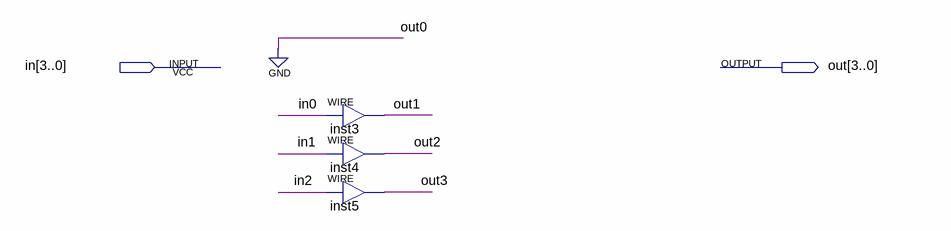
[diagram p0: schematic sheet]
// Quartus schematic shifter.bdf as structural Verilog: 3 symbols, 2 pins
module shifter (
  input  [3:0] in,
  output [3:0] out
);

  assign out[1] = in[0];  // WIRE inst3
  assign out[2] = in[1];  // WIRE inst4
  assign out[3] = in[2];  // WIRE inst5

  assign out[0] = 1'b0;
endmodule
